# EAGLE design Multimode-VCF-LM13600.old (EAGLE 7.6.0)
Single-Supply OTA-Based Multimode VCF http://houshu.at.webry.info/201202/article_1.html
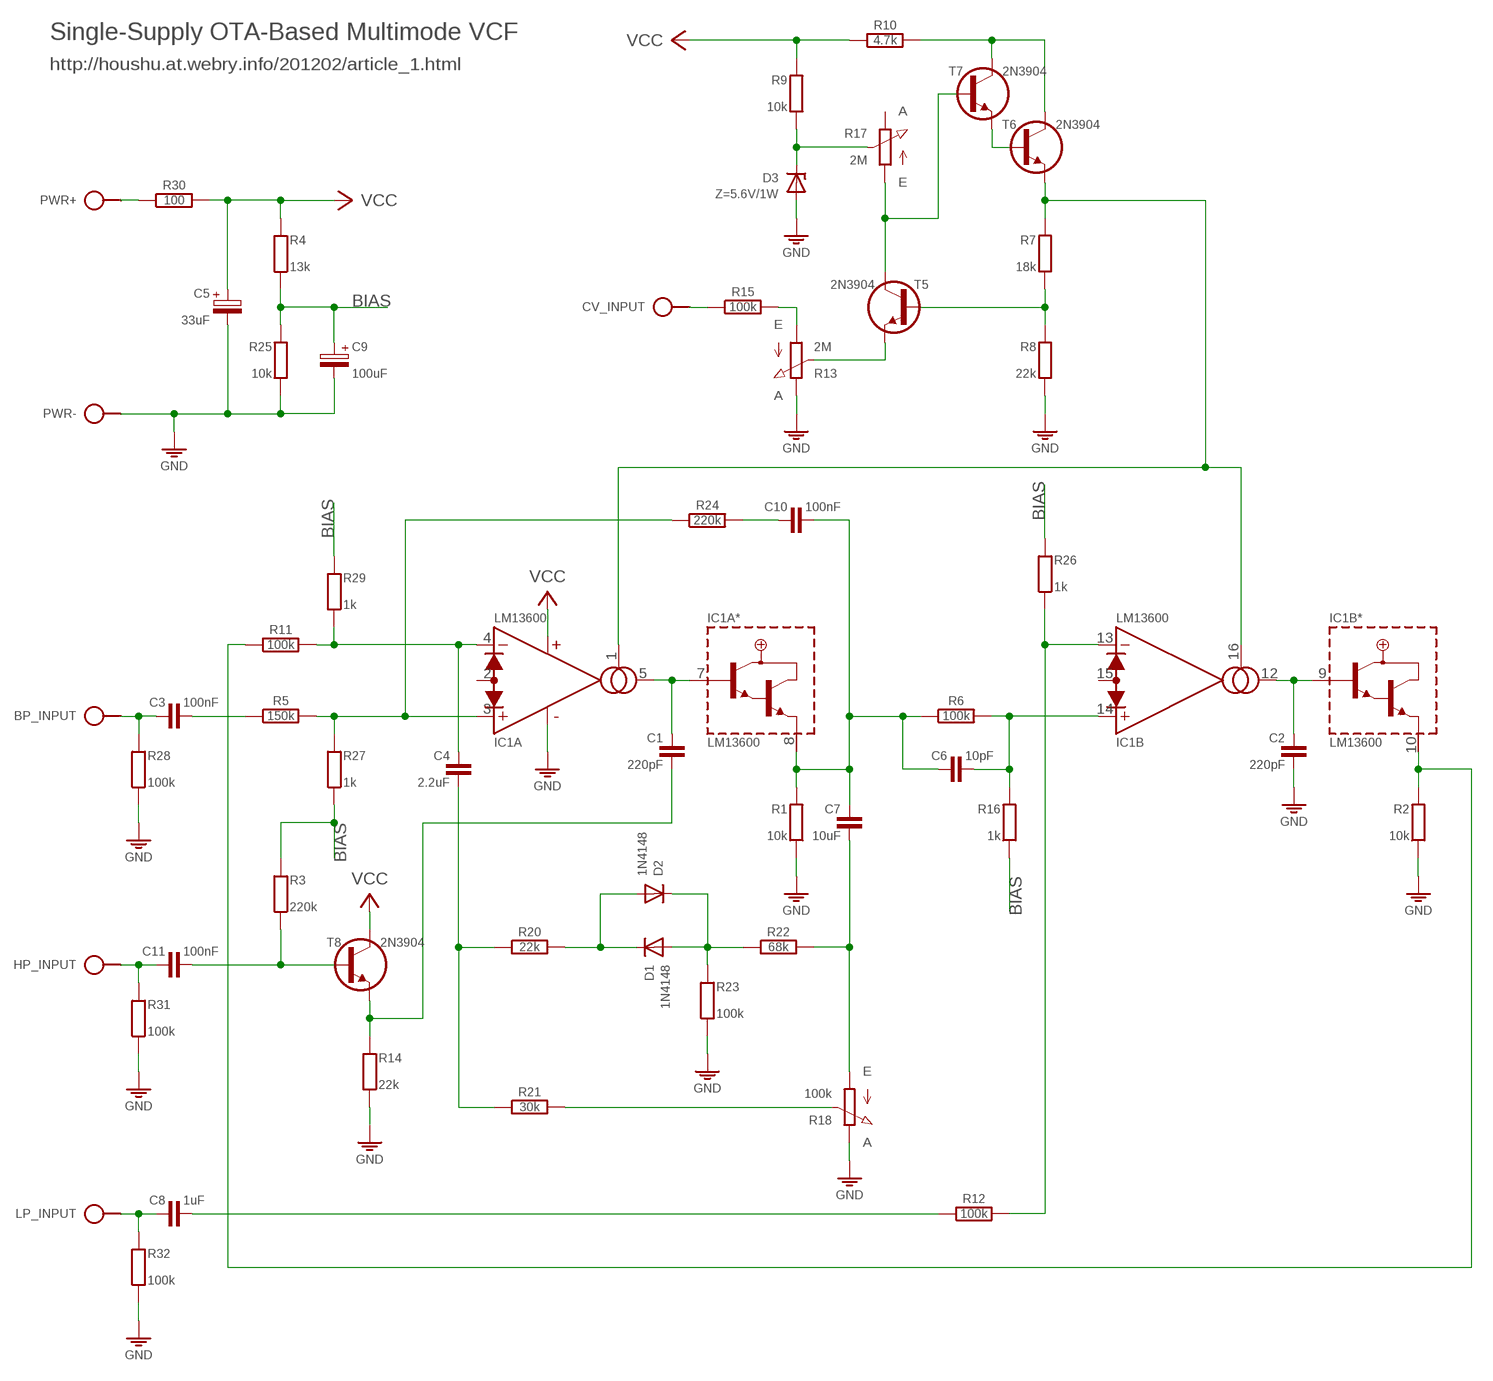
[diagram p0: schematic, sheet 1]

## Parts
BP_INPUT  SPAD  [SPAD]
C1  220pF  C050-020X036/V  [C050-020X036/V]
C2  220pF  C050-020X036/V  [C050-020X036/V]
C3  100nF  C-H050-020X044  [C050-020X044]
C4  2.2uF  C050-024X044/V  [C050-024X044/V]
C5  33uF  CPOLE2,5-4/V  [E2.5-4/V]
C6  10pF  C-H050-020X036  [C050-020X036]
C7  10uF  C050-020X036/V  [C050-020X036/V]
C8  1uF  C-H050-024X044  [C050-024X044]
C9  100uF  CPOLE2,5-4/V  [E2.5-4/V]
C10  100nF  C-H050-020X044  [C050-020X044]
C11  100nF  C-H050-020X044/V  [C050-020X044/V]
CV_INPUT  SPAD  [SPAD]
D1  1N4148  1N414834-2,5-A  [DO34-2,5-A]
D2  1N4148  1N414834-2,5  [DO34-2,5]
D3  Z=5.6V/1W  Z-DIODE-35Z7/V  [DO35Z7/V]
HP_INPUT  SPAD  [SPAD]
IC1  LM13600  [DIL16]
LP_INPUT  SPAD  [SPAD]
PWR  SPAD+--+  [SPAD-+]
R1  10k  R0204/10-V  [0204/10-V]
R2  10k  R0204/10  [0204/10]
R3  220k  R0204/10-V  [0204/10-V]
R4  13k  R0204/10-V  [0204/10-V]
R5  150k  R-H0204/10  [0204/10]
R6  100k  R-H0204/7-V  [0204/7-V]
R7  18k  R0204/10-V  [0204/10-V]
R8  22k  R0204/10-V  [0204/10-V]
R9  10k  R0204/10-V  [0204/10-V]
R10  4.7k  R-H0204/10  [0204/10]
R11  100k  R-H0204/10  [0204/10]
R12  100k  R-H0204/10  [0204/10]
R13  2M  POT-V  [POT-V]
R14  22k  R0204/10-V  [0204/10-V]
R15  100k  R-H0204/10  [0204/10]
R16  1k  R0204/7-V  [0204/7-V]
R17  2M  POT-V  [POT-V]
R18  100k  POT  [POT]
R20  22k  R-H0204/10  [0204/10]
R21  30k  R-H0204/10  [0204/10]
R22  68k  R-H0204/10  [0204/10]
R23  100k  R0204/10-V  [0204/10-V]
R24  220k  R-H0204/10-V  [0204/10-V]
R25  10k  R0204/10-V  [0204/10-V]
R26  1k  R0204/7  [0204/7]
R27  1k  R0204/10-V  [0204/10-V]
R28  100k  R0204/10-V  [0204/10-V]
R29  1k  R0204/10-V  [0204/10-V]
R30  100  R-H0204/10  [0204/10]
R31  100k  R0204/10-V  [0204/10-V]
R32  100k  R0204/10-V  [0204/10-V]
T5  2N3904  [TO92]
T6  2N3904  [TO92]
T7  2N3904  [TO92]
T8  2N3904  [TO92]

## Nets
BIAS: C9.+ R3.1 R4.2 R16.1 R25.1 R26.2 R27.2 R29.1
GND: C2.2 C5.- C9.- D3.A IC1.6(5:V-) PWR.1 R1.2 R2.1 R8.2 R13.E R14.2 R18.3(E) R23.2 R25.2 R28.2 R31.2 R32.2
N$1: C4.2 R20.1 R21.1
N$2: IC1.3(A:+IN) R5.2 R24.1 R27.1
N$3: C1.2 R14.1 T8.1(E)
N$4: C11.2 R3.2 T8.2(B)
N$5: C1.1 IC1.5(A:OUT) IC1.7(A*:BUFF/IN)
N$6: C6.1 C7.1 C10.2 IC1.8(A*:BUFF/OUT) R1.1 R6.1
N$7: D1.C D2.A R20.2
N$8: D1.A D2.C R22.1 R23.1
N$9: C10.1 R24.2
N$10: C6.2 IC1.14(B:+IN) R6.2 R16.2
N$11: R18.2(S) R21.2
N$12: C7.2 R18.1(A) R22.2
N$13: C4.1 IC1.4(A:-IN) R11.2 R29.2
N$14: IC1.13(B:-IN) R12.2 R26.1
N$15: C8.2 R12.1
N$16: C8.1 LP_INPUT.1 R32.1
N$17: C11.1 HP_INPUT.1 R31.1
N$18: C3.2 R5.1
N$19: BP_INPUT.1 C3.1 R28.1
N$20: C2.1 IC1.9(B*:BUFF/IN) IC1.12(B:OUT)
N$21: IC1.10(B*:BUFF/OUT) R2.2 R11.1
N$22: R17.A T5.3(C) T7.2(B)
N$23: T6.2(B) T7.1(E)
N$24: IC1.1(A:AMP/BIAS) IC1.16(B:AMP/BIAS) R7.1 T6.1(E)
N$25: R7.2 R8.1 T5.2(B)
N$26: D3.C R9.2 R17.S
N$27: R10.2 T6.3(C) T7.3(C)
N$28: R13.S T5.1(E)
N$29: CV_INPUT.1 R15.1
N$30: R13.A R15.2
N$34: PWR.2 R30.1
VCC: C5.+ IC1.11(5:V+) R4.1 R9.1 R10.1 R30.2 T8.3(C)
Unconnected: IC1.2(A:DIODE/BIAS) IC1.15(B:DIODE/BIAS) R17.E

## Notes on the sheet
- Single-Supply OTA-Based Multimode VCF
- http://houshu.at.webry.info/201202/article_1.html

## Library data of the parts
BP_INPUT CV_INPUT HP_INPUT LP_INPUT = pad:SPAD
C1 C2 C4 C7 = c:C: CAPACITOR, European symbol
C3 C6 C8 C10 C11 = c:C-H
C5 C9 = c:CPOL: POLARIZED CAPACITOR, European symbol
D1 D2 = d:1N4148
D3 = d:Z-DIODE
IC1 = ic:LM13600
PWR = pad:SPAD+-
R1-R4 R7-R9 R14 R16 R23 R25-R29 R31 R32 = r:R: RESISTOR, European symbol
R5 R6 R10-R12 R15 R20-R22 R24 R30 = r:R-H
R13 R17 R18 = r:POT
T5-T8 = t:2N3904

## Board
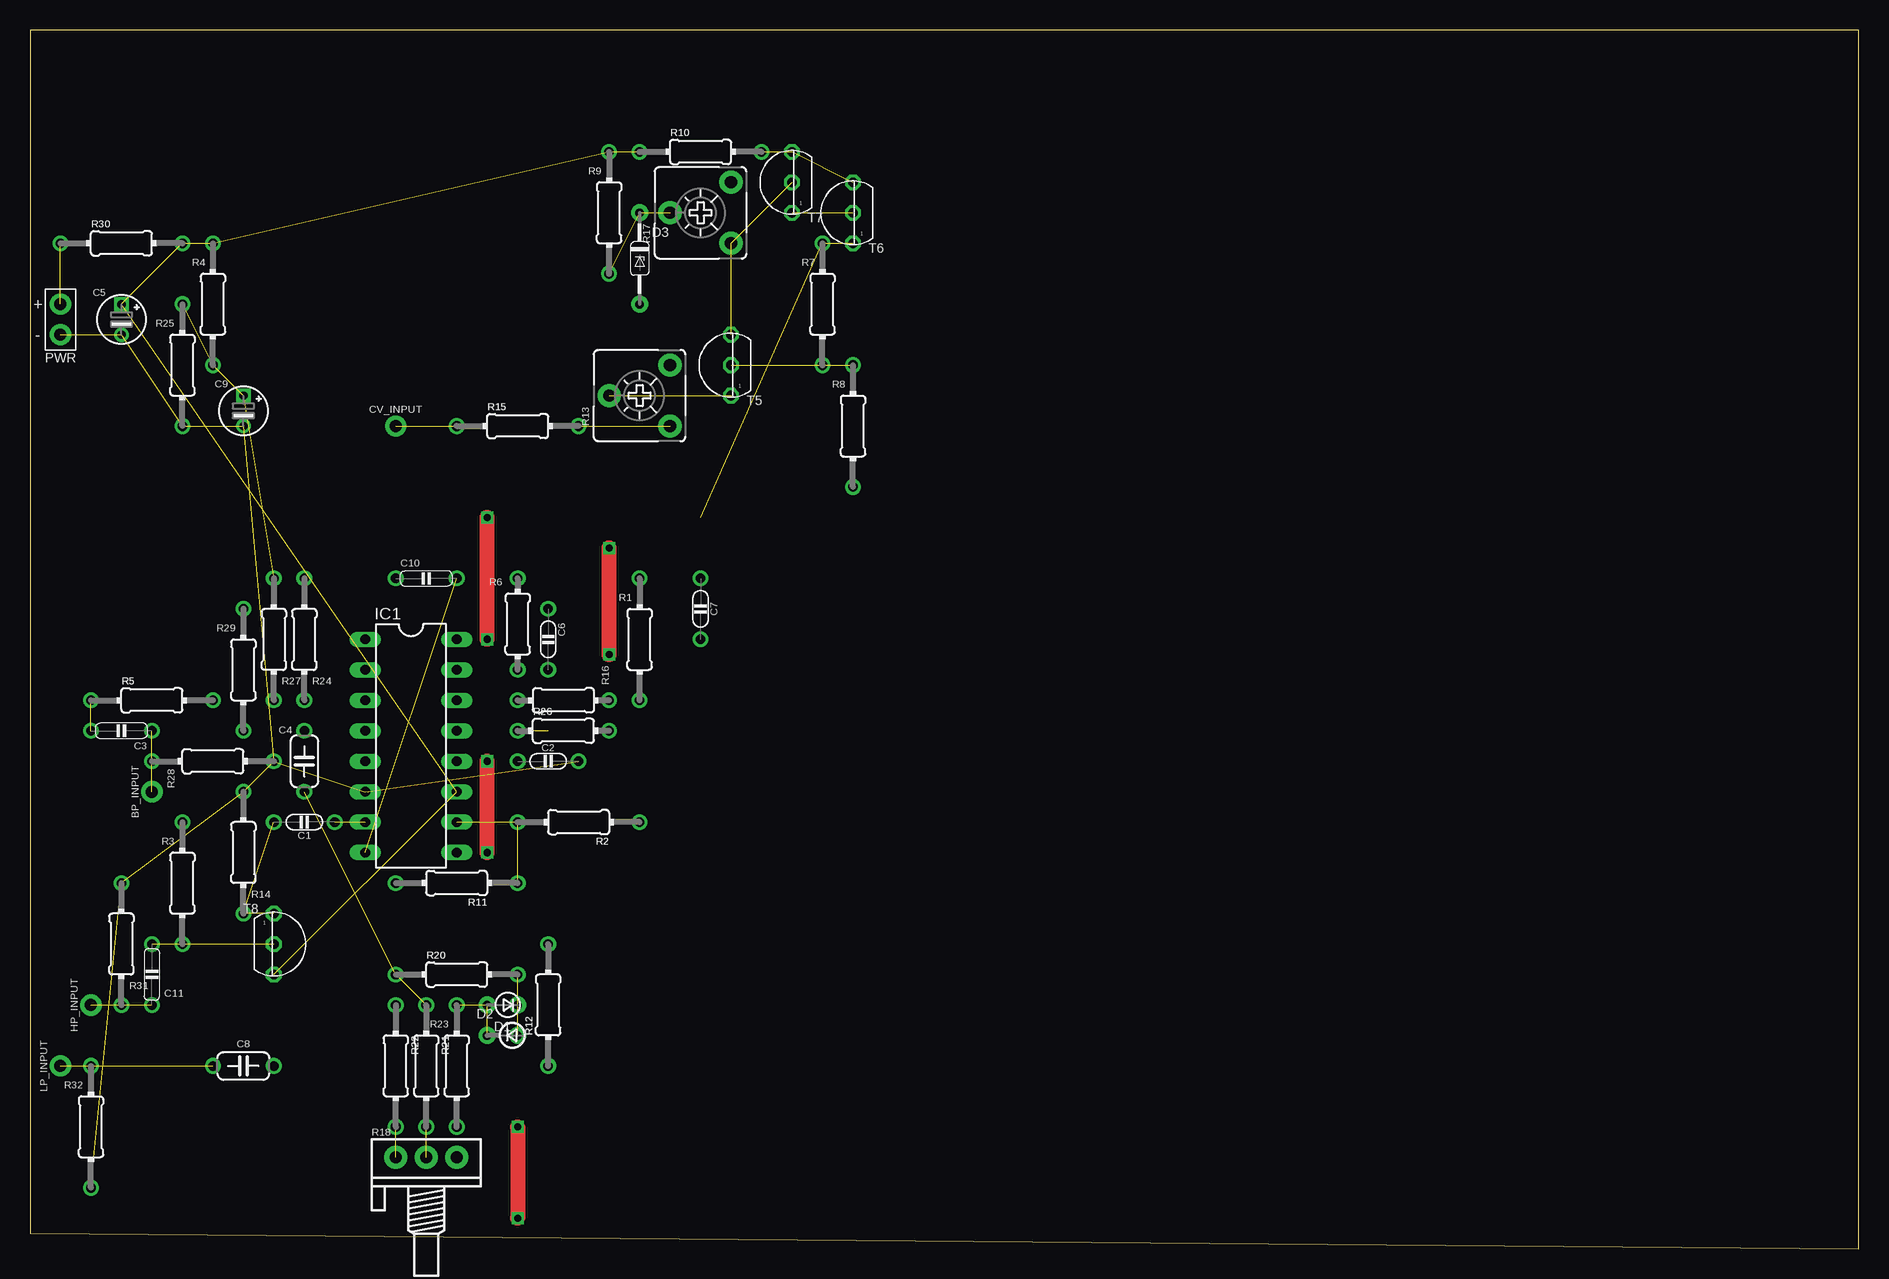
[diagram p1: board, top side]
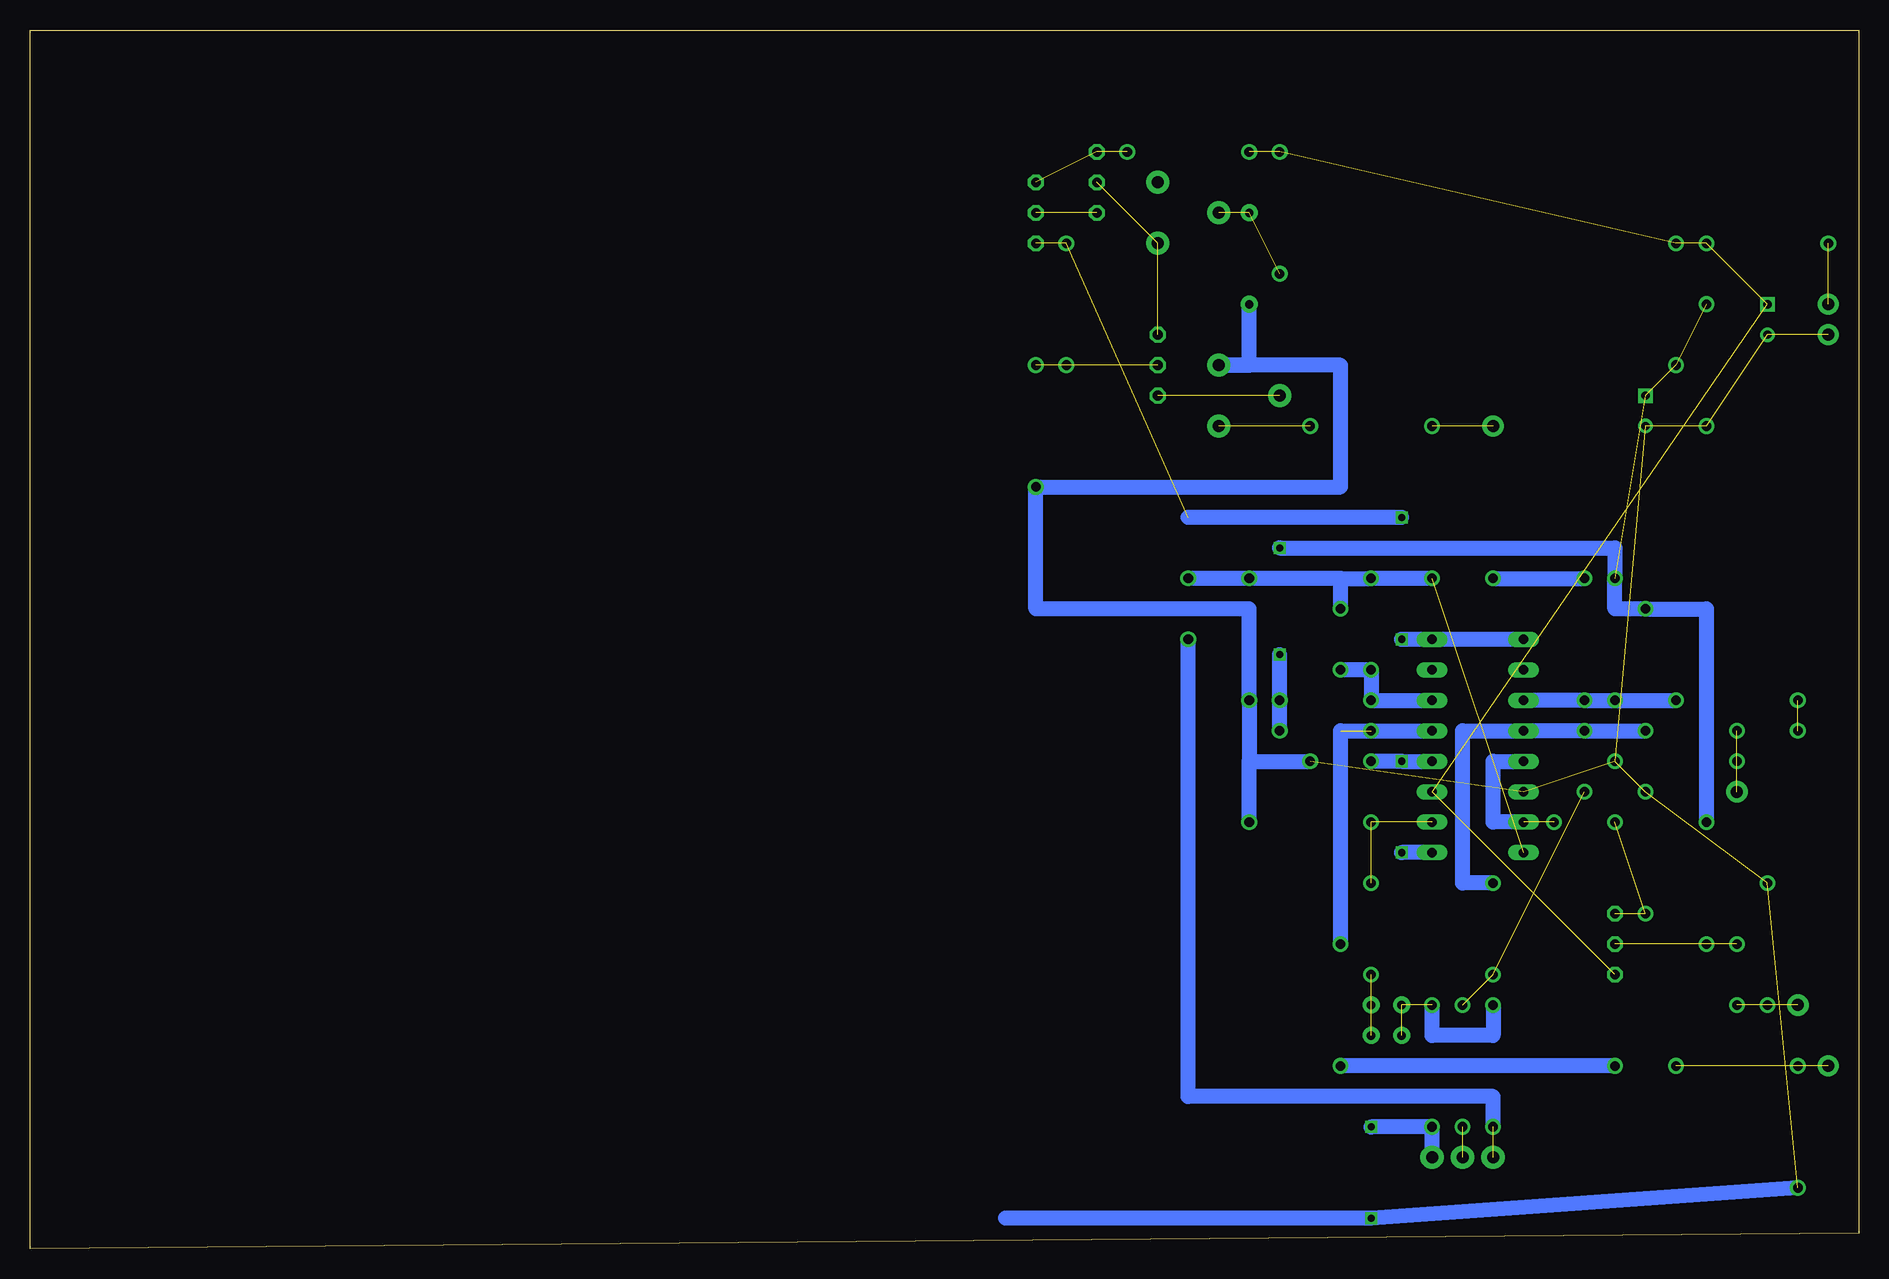
[diagram p2: board, bottom side, seen from below]

Size 152.4 x 101.6 mm. Coordinates in mm from the lower left corner, seen from the top.
Outline: 0,1.27 152.4,0 152.4,101.6 0,101.6 0,1.27
Copper layers (1*16): Top 0.035mm / dielectric 1.5mm / Bottom 0.035mm
Design rules "default": minimum track width 10mil, minimum drill 24mil, track to track 8mil, track to pad 8mil, pad to pad 8mil, via to via 8mil, smd to smd 8mil, copper to edge 40mil, drill to drill 8mil, minimum pad ring 10mil, minimum via ring 8mil, stop-mask expansion 4mil, vias tented up to drill 0mil, thermal gap 10mil

### Footprints (pad centres in the part's own frame; a part is rotated, then mirrored left to right if it is on the bottom)
SPAD = drill 1 pad 1.778: 1 0,0
C050-020X036/V = drill 0.8: 1 0,-2.54; 2 0,2.54
C050-020X044 = drill 0.8: 1 -2.54,0; 2 2.54,0
C050-024X044/V = drill 0.8: 1 0,2.54; 2 0,-2.54
E2.5-4/V = drill 0.7 square: + 0,1.27 | drill 0.7: - 0,-1.27
C050-020X036 = drill 0.8: 1 -2.54,0; 2 2.54,0
C050-024X044 = drill 0.8: 1 -2.54,0; 2 2.54,0
C050-020X044/V = drill 0.8: 1 0,2.54; 2 0,-2.54
DO34-2,5-A = drill 0.7 pad 1.422: A 1.27,0; C -1.27,0
DO34-2,5 = drill 0.7 pad 1.422: A 1.27,0; C -1.27,0
DO35Z7/V = drill 0.7 pad 1.422: A 0,-3.81; C 0,3.81
DIL16 = drill 0.8 long: 1 -3.81,8.89; 2 -3.81,6.35; 3 -3.81,3.81; 4 -3.81,1.27; 5 -3.81,-1.27; 6 -3.81,-3.81; 7 -3.81,-6.35; 8 -3.81,-8.89; 9 3.81,-8.89; 10 3.81,-6.35; 11 3.81,-3.81; 12 3.81,-1.27; 13 3.81,1.27; 14 3.81,3.81; 15 3.81,6.35; 16 3.81,8.89
SPAD-+ = drill 1 pad 1.778: 1 0,-1.27; 2 0,1.27
0204/10-V = drill 0.8: 1 0,5.08; 2 0,-5.08
0204/10 = drill 0.8: 1 -5.08,0; 2 5.08,0
0204/7-V = drill 0.8: 1 0,3.81; 2 0,-3.81
POT-V = drill 1.016 pad 1.93: A -2.54,-2.54; E 2.54,-2.54; S 0,2.54
POT = drill 1 pad 1.93: 1 -2.54,0; 2 0,0; 3 2.54,0
0204/7 = drill 0.8: 1 -3.81,0; 2 3.81,0
TO92 = drill 0.8 octagon: 1 0,2.54; 2 0,0; 3 0,-2.54

### Placement (x,y rotation side)
BP_INPUT  10.16,38.1 0 top
C1  22.86,35.56 90 top
C2  43.18,40.64 270 top
C3  7.62,43.18 180 top
C4  22.86,40.64 0 top
C5  7.62,77.47 0 top
C6  43.18,50.8 270 top
C7  55.88,53.34 180 top
C8  17.78,15.24 0 top
C9  17.78,69.85 0 top
C10  33.02,55.88 0 top
C11  10.16,22.86 180 top
CV_INPUT  30.48,68.58 270 top
D1  39.37,20.32 180 top
D2  39.37,17.78 0 top
D3  50.8,82.55 0 top
HP_INPUT  5.08,20.32 0 top
IC1  31.75,41.91 0 top
LP_INPUT  2.54,15.24 0 top
PWR  2.54,77.47 0 top
R1  50.8,50.8 0 top
R2  45.72,35.56 180 top
R3  12.7,30.48 0 top
R4  15.24,78.74 0 top
R5  10.16,45.72 0 top
R6  40.64,52.07 0 top
R7  66.04,78.74 0 top
R8  68.58,68.58 0 top
R9  48.26,86.36 0 top
R10  55.88,91.44 0 top
R11  35.56,30.48 180 top
R12  43.18,20.32 90 top
R13  50.8,71.12 90 top
R14  17.78,33.02 180 top
R15  40.64,68.58 0 top
R16  44.45,45.72 270 top
R17  55.88,86.36 90 top
R18  33.02,7.62 0 top
R20  35.56,22.86 0 top
R21  33.02,15.24 270 top
R22  30.48,15.24 270 top
R23  35.56,15.24 0 top
R24  22.86,50.8 180 top
R25  12.7,73.66 0 top
R26  44.45,43.18 0 top
R27  20.32,50.8 180 top
R28  15.24,40.64 90 top
R29  17.78,48.26 0 top
R30  7.62,83.82 0 top
R31  7.62,25.4 180 top
R32  5.08,10.16 0 top
T5  58.42,73.66 180 top
T6  68.58,86.36 180 top
T7  63.5,88.9 180 top
T8  20.32,25.4 0 top

### Tracks (layer width: path | path; a pad name or v marks a point on that pad's centre or on a via)
BIAS  (via drill 0.6)  (3 unrouted)
  Top 1.27: v48.26,49.53 v48.26,58.42
  Bottom 1.27: R26.2 R16.1 v48.26,49.53 | v48.26,58.42 20.32,58.42 R27.2 20.32,53.34 R29.1 12.7,53.34 R3.1
GND  (via drill 0.6)  (9 unrouted)
  Top 1.27: v40.64,10.16 v40.64,2.54
  Bottom 1.27: R32.2 v40.64,2.54 71.12,2.54 | R18.3 R23.2 v40.64,10.16 | 50.8,40.64 R1.2 50.8,53.34 68.58,53.34 R8.2 43.18,63.5 43.18,73.66 R13.E 50.8,73.66 D3.A | 50.8,40.64 C2.2 | R2.1 50.8,40.64
N$1  (2 unrouted)
N$2
  Bottom 1.27: IC1.3 R24.1 R27.1 R5.2
N$3  (2 unrouted)
N$4  (2 unrouted)
N$5  (1 unrouted)
  Bottom 1.27: IC1.7 30.48,35.56 30.48,40.64 IC1.5
N$6  (1 unrouted)
  Bottom 1.27: C10.2 R6.1 43.18,55.88 | 43.18,55.88 R1.1 C7.1 | C6.1 43.18,55.88
N$7  (2 unrouted)
N$8  (2 unrouted)
  Bottom 1.27: R22.1 30.48,17.78 35.56,17.78 R23.1
N$9
  Bottom 1.27: C10.1 R24.2
N$10
  Bottom 1.27: C6.2 R6.2 R16.2 IC1.14
N$11  (1 unrouted)
N$12  (1 unrouted)
  Bottom 1.27: R22.2 30.48,12.7 55.88,12.7 C7.2
N$13
  Bottom 1.27: R11.2 33.02,30.48 33.02,43.18 IC1.4 C4.1 R29.2
N$14  (1 unrouted)
  Bottom 1.27: R12.2 43.18,43.18 IC1.13
N$15
  Bottom 1.27: C8.2 R12.1
N$16  (2 unrouted)
N$17  (2 unrouted)
N$18  (1 unrouted)
N$19  (2 unrouted)
N$20  (via drill 0.6)
  Top 1.27: v38.1,33.02 v38.1,40.64
  Bottom 1.27: IC1.9 v38.1,33.02 | C2.1 v38.1,40.64 IC1.12
N$21  (2 unrouted)
N$22  (2 unrouted)
N$23  (1 unrouted)
N$24  (via drill 0.6)  (2 unrouted)
  Top 1.27: v38.1,50.8 v38.1,60.96
  Bottom 1.27: IC1.1 IC1.16 v38.1,50.8 | v38.1,60.96 55.88,60.96
N$25  (2 unrouted)
N$26  (2 unrouted)
N$27  (2 unrouted)
N$28  (1 unrouted)
N$29  (1 unrouted)
N$30  (1 unrouted)
N$34  (1 unrouted)
VCC  (6 unrouted)